# Altium schematic sheet MercurialSDR_FTDI.SchDoc: p2020 v1
size A4; Author: RF-Lab; DrawnBy: RF-Lab; Revision: Rev1.0; SheetNumber: 3; SheetTotal: 6; ProjectName: MercurialSDR
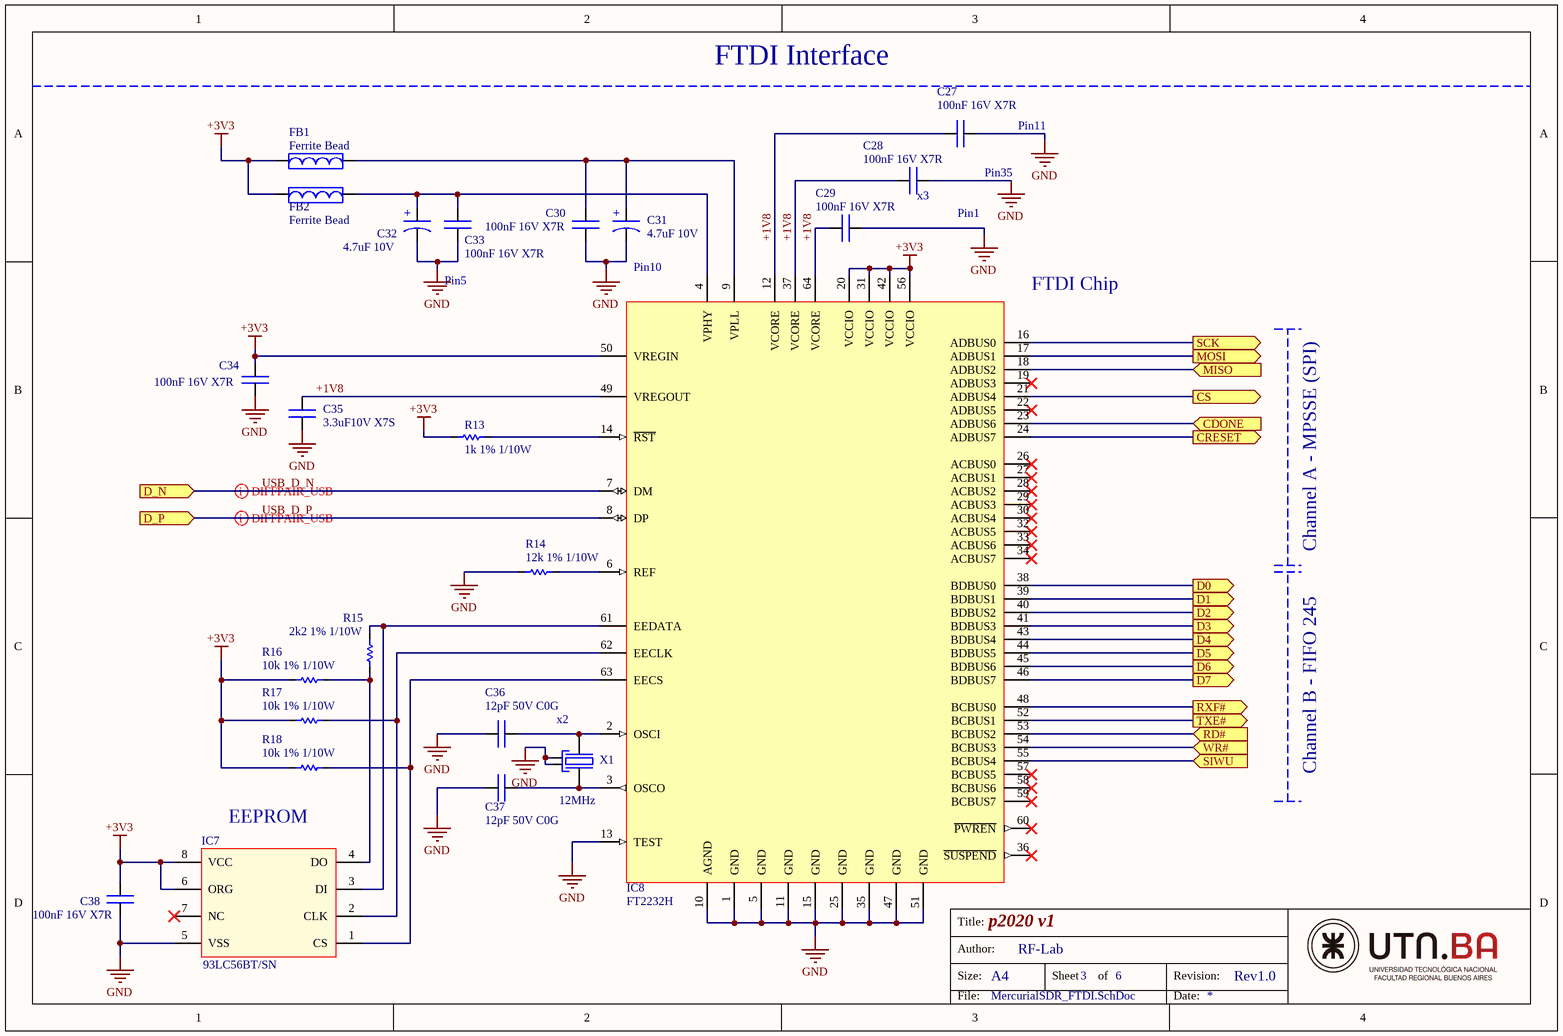
[diagram p0: MercurialSDR_FTDI.SchDoc]

## Parts
C27  value 100nF 16V X7R  [CAP_0603]  (hidden comment: 100nF 16V X7R - CL10B104KO8NNNC)
C28  value 100nF 16V X7R  [CAP_0603]  (hidden comment: 100nF 16V X7R - CL10B104KO8NNNC)
C29  value 100nF 16V X7R  [CAP_0603]  (hidden comment: 100nF 16V X7R - CL10B104KO8NNNC)
C30  value 100nF 16V X7R  [CAP_0603]  (hidden comment: 100nF 16V X7R - CL10B104KO8NNNC)
C31  value 4.7uF 10V  [CAP_TANT_1206]  (hidden comment: 4.7uF 10V - TAJA475K010RNJ)
C32  value 4.7uF 10V  [CAP_TANT_1206]  (hidden comment: 4.7uF 10V - TAJA475K010RNJ)
C33  value 100nF 16V X7R  [CAP_0603]  (hidden comment: 100nF 16V X7R - CL10B104KO8NNNC)
C34  value 100nF 16V X7R  [CAP_0603]  (hidden comment: 100nF 16V X7R - CL10B104KO8NNNC)
C35  value 3.3uF10V X7S  [CAP_0603]  (hidden comment: 3.3uF10V X7S - C1608X7S1A335K080AC)
C36  value 12pF 50V C0G  [CAP_0603]  (hidden comment: 12pF 50V C0G - CL10C120JB8NNNC)
C37  value 12pF 50V C0G  [CAP_0603]  (hidden comment: 12pF 50V C0G - CL10C120JB8NNNC)
C38  value 100nF 16V X7R  [CAP_0603]  (hidden comment: 100nF 16V X7R - CL10B104KO8NNNC)
FB1  BLM18AG121SN1D  [FERRITE_BEAD_0603]  (value not drawn)
FB2  BLM18AG121SN1D  [FERRITE_BEAD_0603]  (value not drawn)
IC7  93LC56BT  [SOIC-8]  (value not drawn)
IC8  value FT2232H  [LQFP_64]  (hidden comment: FT2232HL-TRAY)
R13  value 1k 1% 1/10W  [RES_0603]  (hidden comment: 1k 1% 1/10W - CR0603-FX-1001ELF)
R14  value 12k 1% 1/10W  [RES_0603]  (hidden comment: 12k 1% 1/10W - CR0603-FX-1202ELF)
R15  value 2k2 1% 1/10W  [RES_0603]  (hidden comment: 2k2 1% 1/10W - AC0603FR-072K2L)
R16  value 10k 1% 1/10W  [RES_0603]  (hidden comment: 10k 1% 1/10W - CR0603-FX-1002EAS)
R17  value 10k 1% 1/10W  [RES_0603]  (hidden comment: 10k 1% 1/10W - CR0603-FX-1002EAS)
R18  value 10k 1% 1/10W  [RES_0603]  (hidden comment: 10k 1% 1/10W - CR0603-FX-1002EAS)
X1  value 12MHz  [XTAL_3.2x2.5]  (hidden comment: ECS-120-12-33-AGN-TR)

## Ports
CDONE (in), CRESET (out), CS (out), D0 (out), D1 (out), D2 (out), D3 (out), D4 (out), D5 (out), D6 (out), D7 (out), D_N (in), D_P (in), MISO (in), MOSI (out), RD# (in), RXF# (out), SCK (out), SIWU (in), TXE# (out), WR# (in)

## Nets
+3V3: C34.1 C38.1 FB1.1 FB2.1 IC7.6(ORG) IC7.8(VCC) IC8.20(VCCIO) IC8.31(VCCIO) IC8.42(VCCIO) IC8.50(VREGIN) IC8.56(VCCIO) R13.2 R16.2 R17.1 R18.1
GND: C27.2 C28.2 C29.2 C30.2 C31.2 C32.2 C33.2 C34.2 C35.2 C36.2 C37.1 C38.2 IC7.5(VSS) IC8.1(GND) IC8.5(GND) IC8.10(AGND) IC8.11(GND) IC8.13(TEST) IC8.15(GND) IC8.25(GND) IC8.35(GND) IC8.47(GND) IC8.51(GND) R14.2 X1.2 X1.4
+1V8: C27.1 C28.1 C29.1 C35.1 IC8.12(VCORE) IC8.37(VCORE) IC8.49(VREGOUT) IC8.64(VCORE)
CDONE: IC8.23(ADBUS6) ; port CDONE
CRESET: IC8.24(ADBUS7) ; port CRESET
CS: IC8.21(ADBUS4) ; port CS
D0: IC8.38(BDBUS0) ; port D0
D1: IC8.39(BDBUS1) ; port D1
D2: IC8.40(BDBUS2) ; port D2
D3: IC8.41(BDBUS3) ; port D3
D4: IC8.43(BDBUS4) ; port D4
D5: IC8.44(BDBUS5) ; port D5
D6: IC8.45(BDBUS6) ; port D6
D7: IC8.46(BDBUS7) ; port D7
MISO: IC8.18(ADBUS2) ; port MISO
MOSI: IC8.17(ADBUS1) ; port MOSI
RD#: IC8.53(BCBUS2) ; port RD#
RXF#: IC8.48(BCBUS0) ; port RXF#
SCK: IC8.16(ADBUS0) ; port SCK
SIWU: IC8.55(BCBUS4) ; port SIWU
TXE#: IC8.52(BCBUS1) ; port TXE#
USB_D_N: IC8.7(DM) ; port D_N
USB_D_P: IC8.8(DP) ; port D_P
WR#: IC8.54(BCBUS3) ; port WR#
NetC30_1: C30.1 C31.1 FB1.2 IC8.9(VPLL)
NetC32_1: C32.1 C33.1 FB2.2 IC8.4(VPHY)
NetC36_1: C36.1 IC8.2(OSCI) X1.1
NetC37_2: C37.2 IC8.3(OSCO) X1.3
NetIC7_1: IC7.1(CS) IC8.63(EECS) R18.2
NetIC7_2: IC7.2(CLK) IC8.62(EECLK) R17.2
NetIC7_3: IC7.3(DI) IC8.61(EEDATA) R15.2
NetIC7_4: IC7.4(DO) R15.1 R16.1
NetIC8_6: IC8.6(REF) R14.1
NetIC8_14: IC8.14(~{RST}) R13.1

Not connected (* = marked no-connect by the designer): IC7 7(NC)*; IC8 19(ADBUS3)* 22(ADBUS5)* 26(ACBUS0)* 27(ACBUS1)* 28(ACBUS2)* 29(ACBUS3)* 30(ACBUS4)* 32(ACBUS5)* 33(ACBUS6)* 34(ACBUS7)* 36(~{SUSPEND})* 57(BCBUS5)* 58(BCBUS6)* 59(BCBUS7)* 60(~{PWREN})*

## Layout directives
differential pair: USB_D_N, USB_D_P

## Notes on the sheet
- FTDI Interface
- (near C27) Pin35
- Pin11
- (near C28) x3
- Pin1
- Pin5
- Pin10
- (near IC8) FTDI Chip
- Channel A - MPSSE (SPI)
- (near X1) x2
- Channel B - FIFO 245
- EEPROM
- Title:
- Size:
- Author:
- A4
- Sheet
- of
- Revision:
- File:
- Date:
- (in symbol Cap Pol) +

## Library data of the parts
C27-C30 C33-C37 = Cap: Capacitor no polarizado
C31 C32 = Cap Pol: Capacitor polarizado
C38 = Cap: Capacitor no polarizado; Material: Ceramic; Temp Coef: X7R; Part Number: CL10B104KO8NNNC; VR: 16V
FB1 FB2 = Ferrite Bead: Part Number: BLM18AG121SN1D; In: Ferrite Bead
IC7 = 93LC56BT/SN: EEPROM SPI 2kb (128x16); Part Number: 93LC56BT/SN
IC8 = FT2232H: USB bridge
R13-R18 = Res: Resistor
  R14: Power: 1/10W; Part Number: CR0603-FX-1202ELF; Tolerance: 1%
X1 = XTAL_4term: Oscilador a Cristal; Part Number: ECS-120-12-33-AGN-TR